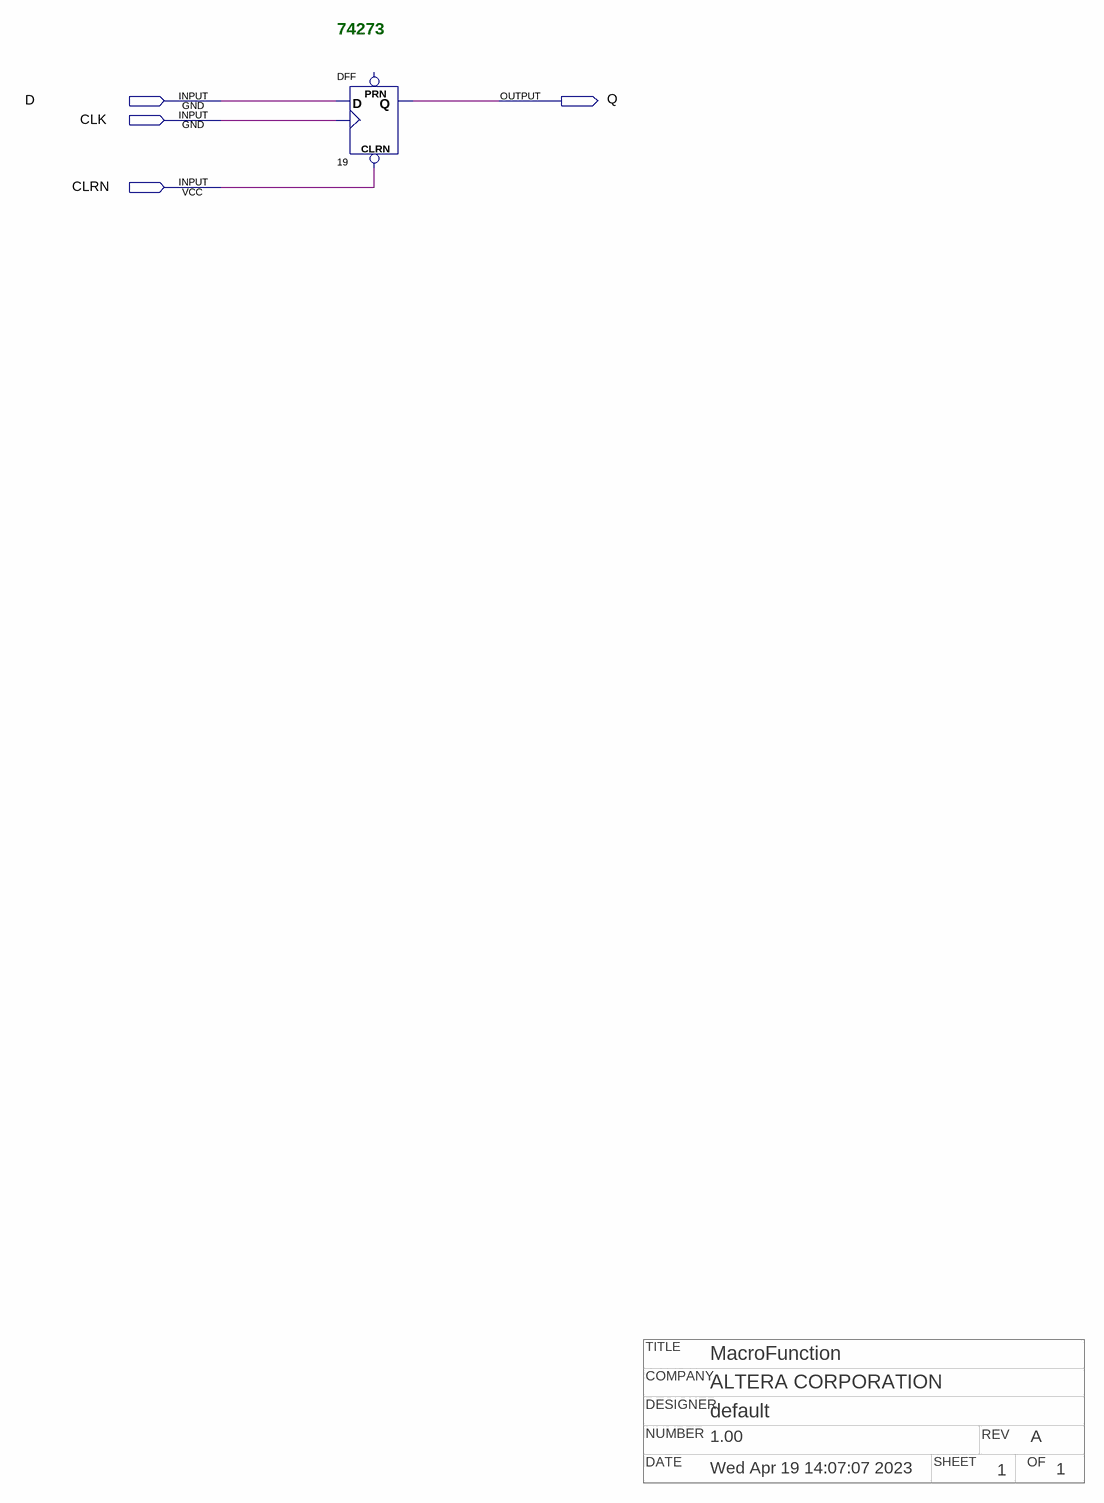
[diagram p0: schematic sheet]
// Quartus schematic 1273.bdf as structural Verilog: 1 symbols, 4 pins
// Title block: TITLE: MacroFunction; COMPANY: ALTERA CORPORATION; DESIGNER: default; NUMBER: 1.00; REV: A; DATE: Wed Apr 19 14:07:07 2023; SHEET: 1; OF: 1
module \1273  (
  input  D,
  input  CLK,
  input  CLRN,
  output Q
);

  DFF u_19 (.CLRN(CLRN), .CLK(CLK), .D(D), .Q(Q));  // open: PRN

  // Notes on the sheet:
  //   74273
endmodule
